# Altium project PCB_Project.PrjPcb
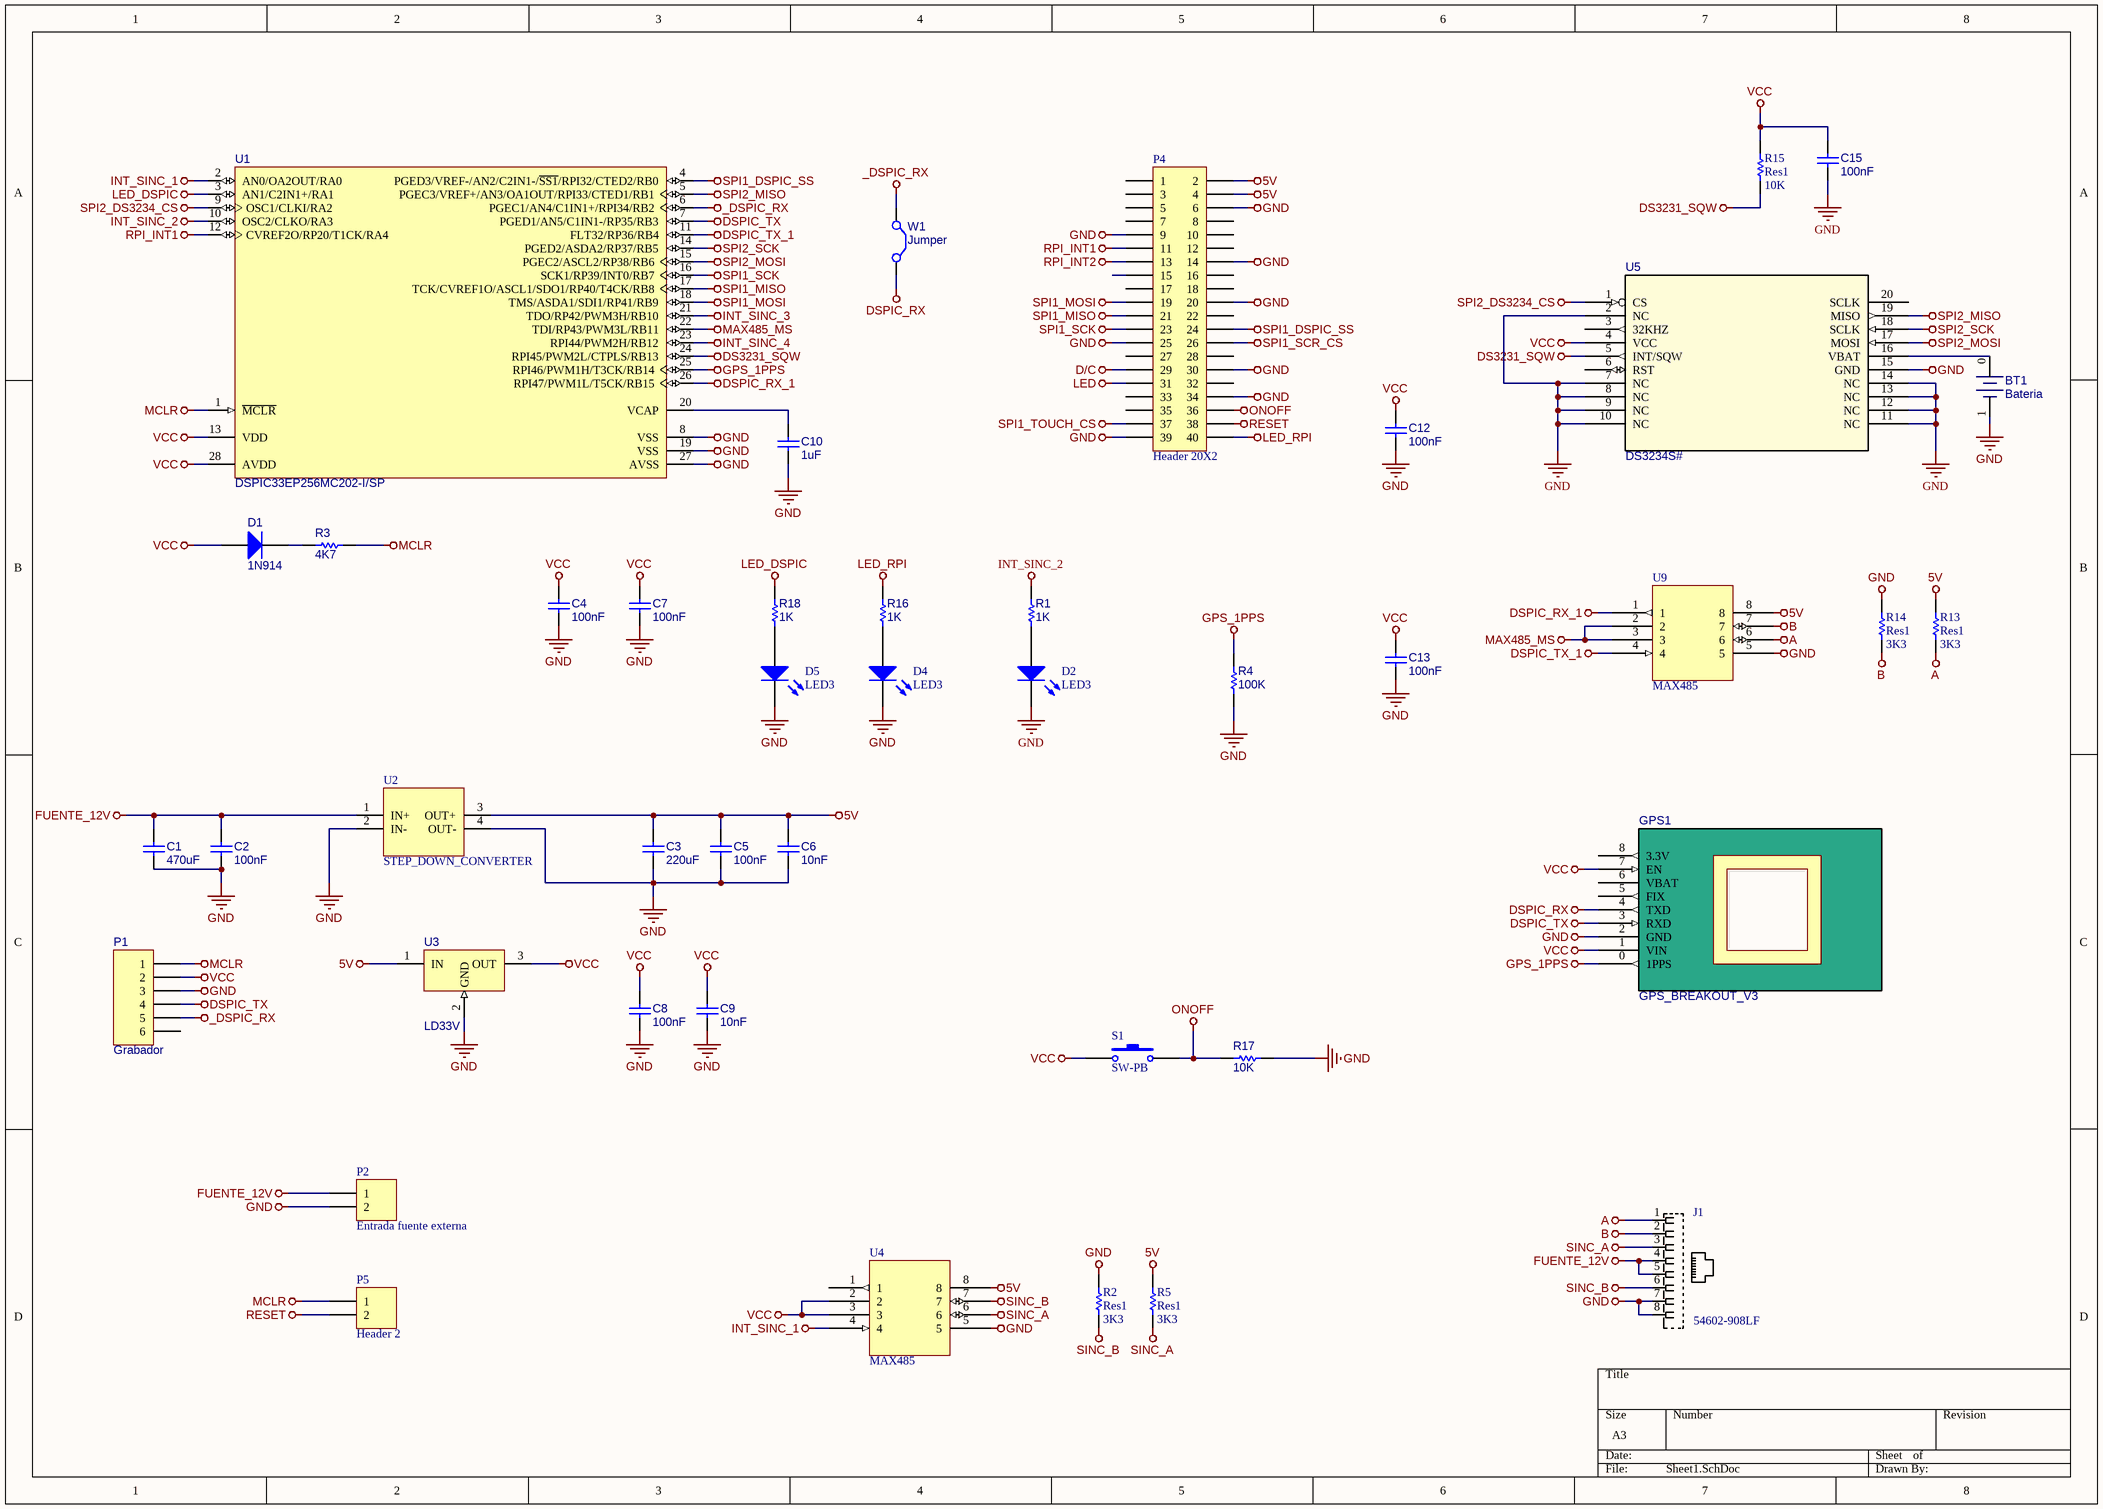
[diagram p0: Sheet1.SchDoc]
1 sheet, 43 parts. Net scope: global (net labels, ports and power ports of the same name join across sheets).
Board files: PCB1.PcbDoc, imprimir.PcbDoc

## Sheet Sheet1.SchDoc
size A3

### Parts
BT1  Bateria  [Bateria-DS1307]
C1  value 470uF  [C100UFB]  (hidden comment: Cap)
C2  value 100nF  [RAD0.2]  (hidden comment: Cap)
C3  value 220uF  [C100UFB]  (hidden comment: Cap)
C4  value 100nF  [RAD0.2]  (hidden comment: Cap)
C5  value 100nF  [RAD0.2]  (hidden comment: Cap)
C6  value 10nF  [RAD0.2]  (hidden comment: Cap)
C7  value 100nF  [RAD0.2]  (hidden comment: Cap)
C8  value 100nF  [RAD0.2]  (hidden comment: Cap)
C9  value 10nF  [RAD0.2]  (hidden comment: Cap)
C10  value 1uF  [RAD0.2]  (hidden comment: Cap)
C12  value 100nF  [RAD0.2]  (hidden comment: Cap)
C13  value 100nF  [RAD0.2]  (hidden comment: Cap)
C15  value 100nF  [RAD0.2]  (hidden comment: Cap)
D1  1N914  [DO-35]
D2  LED3  [Led_Green]
D4  LED3  [Led_Green]
D5  LED3  [Led_Green]
GPS1  GPS_BREAKOUT_V3  [GPS_BREAKOUT_V3]
J1  54602-908LF  [*AMPHENOL_54602-908LF]
P1  Grabador  [HDR1X6]
P2  Entrada fuente externa  [MOLEX-2]
P4  Header 20X2  [HDR2X20]
P5  Header 2  [Header 1X2]
R1  value 1K  [AXIAL-0.3 RES-1/4W]  (hidden comment: Res1)
R2  Res1  value 3K3  [AXIAL-0.3 RES-1/4W]
R3  value 4K7  [AXIAL-0.3]  (hidden comment: Res1)
R4  value 100K  [AXIAL-0.3]  (hidden comment: Res1)
R5  Res1  value 3K3  [AXIAL-0.3 RES-1/4W]
R13  Res1  value 3K3  [AXIAL-0.3]
R14  Res1  value 3K3  [AXIAL-0.3]
R15  Res1  value 10K  [AXIAL-0.3]
R16  value 1K  [AXIAL-0.3]  (hidden comment: Res1)
R17  value 10K  [AXIAL-0.3]  (hidden comment: Res1)
R18  value 1K  [AXIAL-0.3]  (hidden comment: Res1)
S1  SW-PB  [PULSA4]
U1  DSPIC33EP256MC202-I/SP  [MCHP-SPDIP-SP28]
U2  STEP_DOWN_CONVERTER  [STEP_DOWN_CONVERTER]
U3  LD33V  [SOT-223]
U4  MAX485  [DIP794W47P254L991H457Q8]
U5  DS3234S#  [21-0042B_20]
U9  MAX485  [DIP794W47P254L991H457Q8]
W1  Jumper  [SIP-2]

### Nets
5V: C3.1 C5.1 C6.1 P4.2 P4.4 R5.2 R13.2 U2.3(OUT+) U3.1(IN) U4.8 U9.8
_DSPIC_RX: P1.5 U1.6(PGEC1/AN4/C1IN1+/RPI34/RB2) W1.1(C1)
A: J1.1 R13.1 U9.6
B: J1.2 R14.1 U9.7
D/C: P4.29
DS3231_SQW: R15.1 U1.24(RPI45/PWM2L/CTPLS/RB13) U5.5(INT/SQW)
DSPIC_RX: GPS1.4(TXD) W1.2(C2)
DSPIC_RX_1: U1.26(RPI47/PWM1L/T5CK/RB15) U9.1
DSPIC_TX: GPS1.3(RXD) P1.4 U1.7(PGED1/AN5/C1IN1-/RP35/RB3)
DSPIC_TX_1: U1.11(FLT32/RP36/RB4) U9.4
FUENTE_12V: C1.1 C2.1 J1.4 J1.5 P2.1 U2.1(IN+)
GND: BT1.1(-) C1.2 C2.2 C3.2 C4.2 C5.2 C6.2 C7.2 C8.2 C9.2 C10.2 C12.2 C13.2 C15.2 D2.2(K) D4.2(K) D5.2(K) GPS1.2(GND) J1.7 J1.8 P1.3 P2.2 P4.6 P4.9 P4.14 P4.20 P4.25 P4.30 P4.34 P4.39 R2.2 R4.2 R14.2 R17.2 U1.8(VSS) U1.19(VSS) U1.27(AVSS) U2.2(IN-) U2.4(OUT-) U3.2(GND) U4.5 U5.2(NC) U5.7(NC) U5.8(NC) U5.9(NC) U5.10(NC) U5.11(NC) U5.12(NC) U5.13(NC) U5.14(NC) U5.15(GND) U9.5
GPS_1PPS: GPS1.0(1PPS) R4.1 U1.25(RPI46/PWM1H/T3CK/RB14)
INT_SINC_1: U1.2(AN0/OA2OUT/RA0) U4.4
INT_SINC_2: R1.1 U1.10(OSC2/CLKO/RA3)
INT_SINC_3: U1.21(TDO/RP42/PWM3H/RB10)
INT_SINC_4: U1.23(RPI44/PWM2H/RB12)
LED: P4.31
LED_DSPIC: R18.1 U1.3(AN1/C2IN1+/RA1)
LED_RPI: P4.40 R16.1
MAX485_MS: U1.22(TDI/RP43/PWM3L/RB11) U9.2 U9.3
MCLR: P1.1 P5.1 R3.1 U1.1(~{MCLR})
ONOFF: P4.36 R17.1 S1.2
RESET: P4.38 P5.2
RPI_INT1: P4.11 U1.12(CVREF2O/RP20/T1CK/RA4)
RPI_INT2: P4.13
SINC_A: J1.3 R5.1 U4.6
SINC_B: J1.6 R2.1 U4.7
SPI1_DSPIC_SS: P4.24 U1.4(PGED3/VREF-/AN2/C2IN1-/~{SS1}/RPI32/CTED2/RB0)
SPI1_MISO: P4.21 U1.17(TCK/CVREF1O/ASCL1/SDO1/RP40/T4CK/RB8)
SPI1_MOSI: P4.19 U1.18(TMS/ASDA1/SDI1/RP41/RB9)
SPI1_SCK: P4.23 U1.16(SCK1/RP39/INT0/RB7)
SPI1_SCR_CS: P4.26
SPI1_TOUCH_CS: P4.37
SPI2_DS3234_CS: U1.9(OSC1/CLKI/RA2) U5.1(CS)
SPI2_MISO: U1.5(PGEC3/VREF+/AN3/OA1OUT/RPI33/CTED1/RB1) U5.19(MISO)
SPI2_MOSI: U1.15(PGEC2/ASCL2/RP38/RB6) U5.17(MOSI)
SPI2_SCK: U1.14(PGED2/ASDA2/RP37/RB5) U5.18(SCLK)
VCC: C4.1 C7.1 C8.1 C9.1 C12.1 C13.1 C15.1 D1.1(A) GPS1.1(VIN) GPS1.7(EN) P1.2 R15.2 S1.1 U1.13(VDD) U1.28(AVDD) U3.3(OUT) U4.2 U4.3 U5.4(VCC)
NetBT1_0: BT1.0(+) U5.16(VBAT)
NetC10_1: C10.1 U1.20(VCAP)
NetD1_2: D1.2(K) R3.2
NetD2_1: D2.1(A) R1.2
NetD4_1: D4.1(A) R16.2
NetD5_1: D5.1(A) R18.2

Not connected (* = marked no-connect by the designer): GPS1 5(FIX) 6(VBAT) 8(3.3V); P1 6; P4 1 3 5 7 8 10 12 15 16 17 18 22 27 28 32 33 35; U4 1; U5 3(32KHZ) 6(RST) 20(SCLK)

### Library data of the parts
BT1 = BateriaDS1307
C1-C10 C12 C13 C15 = Cap: Capacitor; Published: 8-Jun-2000; LatestRevisionDate: 17-Jul-2002; LatestRevisionNote: Re-released for DXP Platform.; PackageReference: RAD-0.3; Publisher: Altium Limited; PackageDescription: Radial Cap, Thru-Hole; 2 Leads; 0.3 in Pin Spacing
D1 = Diode 1N914: High Conductance Fast Diode; Published: 8-Jun-2000; LatestRevisionDate: 17-Jul-2002; LatestRevisionNote: Re-released for DXP Platform.; DatasheetVersion: 1997; PackageReference: DO-35; Publisher: Altium Limited; PackageDescription: Diode, Axial; Body 3.8 x 1.9 mm (LxDia. max), Lead Dia. 0.53 mm (max); Code_JEDEC: DO-204-AH; ComponentLink1Description: Manufacturer Link; ComponentLink1URL: http://www.fairchildsemi.com/; ComponentLink2Description: Datasheet; ComponentLink2URL: http://www.fairchildsemi.com/ds/1N%2F1N4448.pdf
D2 D4 D5 = LED3: Typical BLUE SiC LED; Published: 8-Jun-2000; LatestRevisionDate: 17-Dec-2003; LatestRevisionNote: PCB Footprint replaced.; DatasheetVersion: 16-Apr-2002; PackageVersion: 16-Apr-2002; PackageReference: 3.5X2.8X1.9; Publisher: Altium Limited; PackageDescription: SM LED; 2 C-Bend Leads; Body 3.5 x 2.8 x 1.9 mm, inc leads (LxWxH typ)
J1 = 54602-908LF: Jack Modular Connector 8p8c _RJ45, Ethernet_ 90Â° Angle _Right_ Unshielded Cat3; MF: Amphenol ICC; Digi-Key_Part_Number: 609-1046-ND; MP: 54602-908LF; SnapEDA_Link: https://www.snapeda.com/parts/54602-908LF/Amphenol%20FCI/view-part/1356963/?ref=snap; Package: None; Digi-Key_Purchase_URL: https://www.digikey.com/product-detail/en/amphenol-icc-fci/54602-908LF/609-1046-ND/1001360?utm_source=snapeda&utm_medium=aggregator&utm_campaign=symbol; Value: *
P1 = Header 6: Header, 6-Pin; LatestRevisionDate: 17-Jul-2002; LatestRevisionNote: Re-released for DXP Platform.; Publisher: Altium Limited
P2 P5 = Header 2: Header, 2-Pin; LatestRevisionDate: 17-Jul-2002; LatestRevisionNote: Re-released for DXP Platform.; Publisher: Altium Limited
P4 = Header 20X2: Header, 20-Pin, Dual row; LatestRevisionDate: 17-Jul-2002; LatestRevisionNote: Re-released for DXP Platform.; Publisher: Altium Limited
R1-R5 R13-R18 = Res1: Resistor; Published: 8-Jun-2000; LatestRevisionDate: 17-Jul-2002; LatestRevisionNote: Re-released for DXP Platform.; PackageReference: AXIAL-0.3; Publisher: Altium Limited; PackageDescription: Axial Device, Thru-Hole; 2 Leads; 0.3 in Pin Spacing
S1 = SW-PB: Switch; Published: 24-Mar-1999; LatestRevisionDate: 17-Jul-2002; LatestRevisionNote: Re-released for DXP Platform.; PackageReference: SPST-2; Publisher: Altium Limited; PackageDescription: Switch; 2 Leads
U1 = DSPIC33EP256MC202-I/SP: 16-Bit Microcontroller and Digital Signal Controller with High-Speed PWM, Op Amps and Advanced Analog, 70 MIPS, 21 I/O, GPIO, -40 to 85 degC, 28-pin SPDIP (SP28), Tube; Manufacturer: Microchip; DatasheetVersion: Rev. F; PackageVersion: C04-070B; PackageReference: SPDIP-SP28; PackageDescription: 28-Lead Plastic Dual In-Line, 34.86 x 6.79 mm Body, 2.54 mm Pitch; Supplier 1: Digi-Key; Supplier Part Number 1: DSPIC33EP256MC202-I/SP-ND; Supplier 2: Farnell; Supplier Part Number 2: 2212194; Supplier 3: Newark; Supplier Part Number 3: 66T8001; Supplier 4: Mouser; Supplier Part Number 4: 579-PC33256MC202ISP; Mounting Technology: Through Hole; PartNumber: DSPIC33EP256MC202-I/SP; ComponentLink1Description: Manufacturer URL; ComponentLink1URL: http://www.microchip.com; ComponentLink2Description: Datasheet; ComponentLink2URL: http://ww1.microchip.com/downloads/en/DeviceDoc/70657F.pdf; ComponentLink3Description: Package Specification; ComponentLink3URL: http://www.microchip.com/stellent/groups/techpub_sg/documents/packagingspec/en012702.pdf; ComponentLink4Description: Product URL; ComponentLink4URL: http://www.microchip.com/dsPIC33EP256MC202
U3 = LD33V: High-Performance 16-bit Digital Signal Controller, 24 KB Flash, 2 KB SRAM, 1 KB EEPROM, 40-Pin PDIP, Industrial Temperature
U5 = DS3234S#: No Description Available; Vendor: Maxim Integrated Products; Built_By: EMA_UL_Team; Manufacturer_Part_Number: DS3234S#; Copyright: Copyright (C) 2018 Accelerated Designs. All rights reserved; RefDes: RefDes; Type: DEV; Value: Value
W1 = Jumper: Jumper Wire; Published: 24-Mar-1999; LatestRevisionDate: 17-Jul-2002; LatestRevisionNote: Re-released for DXP Platform.; PackageReference: RAD-0.2; Publisher: Altium Limited; PackageDescription: Radial Cap, Thru-Hole; 2 Leads; 0.2 in Pin Spacing